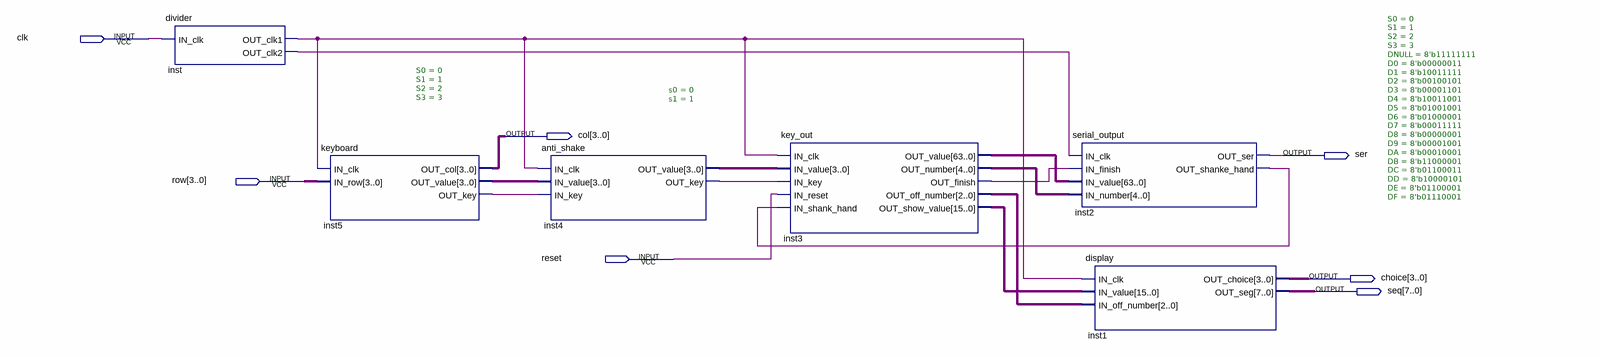
[diagram p0: schematic sheet]
// Quartus schematic serial1.bdf as structural Verilog: 6 symbols, 7 pins
module serial1 (
  input  clk,
  input  [3:0] row,
  input  reset,
  output [3:0] col,
  output ser,
  output [3:0] choice,
  output [7:0] seq
);

  wire inst2_out_shanke_hand, inst3_out_finish, inst4_out_key, inst5_out_key, inst_out_clk1, inst_out_clk2;
  wire [2:0] inst3_out_off_number;
  wire [3:0] inst4_out_value, inst5_out_value;
  wire [4:0] inst3_out_number;
  wire [15:0] inst3_out_show_value;
  wire [63:0] inst3_out_value;

  divider inst (.IN_clk(clk), .OUT_clk1(inst_out_clk1), .OUT_clk2(inst_out_clk2));
  keyboard #(.S0(0), .S1(1), .S2(2), .S3(3)) inst5 (
    .IN_clk(inst_out_clk1), .IN_row(row), .OUT_col(col), .OUT_value(inst5_out_value), .OUT_key(inst5_out_key));
  anti_shake #(.s0(0), .s1(1)) inst4 (
    .IN_clk(inst_out_clk1), .IN_value(inst5_out_value), .IN_key(inst5_out_key), .OUT_value(inst4_out_value),
    .OUT_key(inst4_out_key));
  key_out inst3 (
    .IN_clk(inst_out_clk1), .IN_value(inst4_out_value), .IN_key(inst4_out_key), .IN_reset(reset),
    .IN_shank_hand(inst2_out_shanke_hand), .OUT_value(inst3_out_value), .OUT_number(inst3_out_number),
    .OUT_finish(inst3_out_finish), .OUT_off_number(inst3_out_off_number),
    .OUT_show_value(inst3_out_show_value));
  serial_output inst2 (
    .IN_clk(inst_out_clk2), .IN_finish(inst3_out_finish), .IN_value(inst3_out_value),
    .IN_number(inst3_out_number), .OUT_ser(ser), .OUT_shanke_hand(inst2_out_shanke_hand));
  display #(.S0(0), .S1(1), .S2(2), .S3(3), .DNULL(8'b11111111), .D0(8'b00000011), .D1(8'b10011111), .D2(8'b00100101), .D3(8'b00001101), .D4(8'b10011001), .D5(8'b01001001), .D6(8'b01000001), .D7(8'b00011111), .D8(8'b00000001), .D9(8'b00001001), .DA(8'b00010001), .DB(8'b11000001), .DC(8'b01100011), .DD(8'b10000101), .DE(8'b01100001), .DF(8'b01110001)) inst1 (
    .IN_clk(inst_out_clk1), .IN_value(inst3_out_show_value), .IN_off_number(inst3_out_off_number),
    .OUT_choice(choice), .OUT_seg(seq));
endmodule
